# Altium schematic sheet Core.SchDoc
size A4
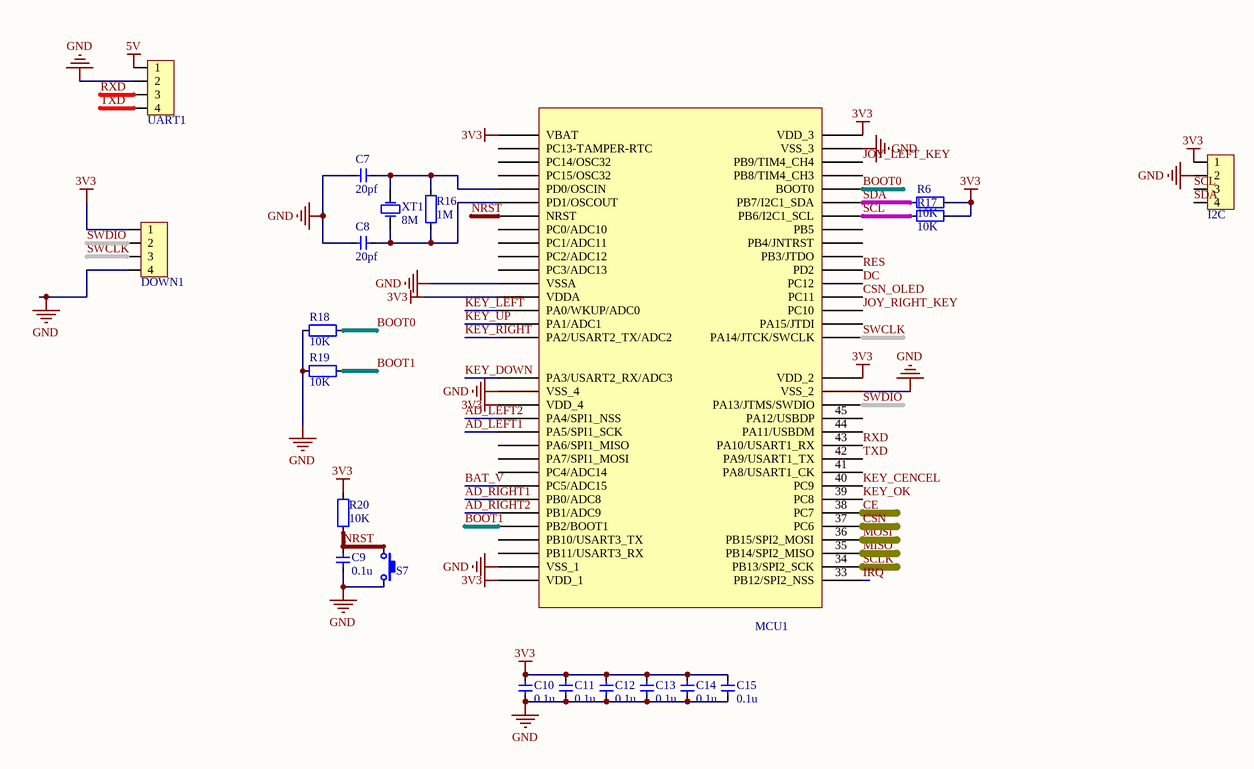
[diagram p0: Core.SchDoc]

## Parts
C7  value 20pf  [CAP_0603]  (hidden comment: Cap_0603)
C8  value 20pf  [CAP_0603]  (hidden comment: Cap_0603)
C9  value 0.1u  [CAP_0603]  (hidden comment: Cap_0603)
C10  value 0.1u  [CAP_0603]  (hidden comment: Cap_0603)
C11  value 0.1u  [CAP_0603]  (hidden comment: Cap_0603)
C12  value 0.1u  [CAP_0603]  (hidden comment: Cap_0603)
C13  value 0.1u  [CAP_0603]  (hidden comment: Cap_0603)
C14  value 0.1u  [CAP_0603]  (hidden comment: Cap_0603)
C15  value 0.1u  [CAP_0603]  (hidden comment: Cap_0603)
DOWN1  HDR1x4_2.54  [HDR1x4_2.54_180]  (value not drawn)
I2C  HDR1x4_2.54  [HDR1x4_2.54_180]  (value not drawn)
MCU1  STM32F103RC  [LQFP_P0.5_64]  (value not drawn)
R6  value 10K  [RES_0603]  (hidden comment: Res_0603)
R16  value 1M  [RES_0603]  (hidden comment: Res_0603)
R17  value 10K  [RES_0603]  (hidden comment: Res_0603)
R18  value 10K  [RES_0603]  (hidden comment: Res_0603)
R19  value 10K  [RES_0603]  (hidden comment: Res_0603)
R20  value 10K  [RES_0603]  (hidden comment: Res_0603)
S7  ButtonTACT_3x4x2_180  [ButtonTACT_3x4x2_180H]  (value not drawn)
UART1  HDR1x4_2.54  [HDR1x4_2.54_180]  (value not drawn)
XT1  value 8M  [XT_5032_2]  (hidden comment: XTAL_5032_2P)

## Nets
3V3: C10.2 C11.2 C12.2 C13.2 C14.2 C15.2 DOWN1.1 I2C.1 MCU1.1(VBAT) MCU1.13(VDDA) MCU1.19(VDD_4) MCU1.32(VDD_1) MCU1.48(VDD_2) MCU1.64(VDD_3) R6.2 R17.2 R20.1
5V: UART1.1
GND: C7.1 C8.1 C9.1 C10.1 C11.1 C12.1 C13.1 C14.1 C15.1 DOWN1.4 I2C.2 MCU1.12(VSSA) MCU1.18(VSS_4) MCU1.31(VSS_1) MCU1.47(VSS_2) MCU1.63(VSS_3) R18.2 R19.2 S7.2 UART1.2
AD_LEFT1: MCU1.21(PA5/SPI1_SCK)
AD_LEFT2: MCU1.20(PA4/SPI1_NSS)
AD_RIGHT1: MCU1.26(PB0/ADC8)
AD_RIGHT2: MCU1.27(PB1/ADC9)
BAT_V: MCU1.25(PC5/ADC15)
BOOT0: MCU1.60(BOOT0) R18.1
BOOT1: MCU1.28(PB2/BOOT1) R19.1
CE: MCU1.38(PC7)
CSN: MCU1.37(PC6)
CSN_OLED: MCU1.52(PC11)
DC: MCU1.53(PC12)
IRQ: MCU1.33(PB12/SPI2_NSS)
JOY_LEFT_KEY: MCU1.62(PB9/TIM4_CH4)
JOY_RIGHT_KEY: MCU1.51(PC10)
KEY_CENCEL: MCU1.40(PC9)
KEY_DOWN: MCU1.17(PA3/USART2_RX/ADC3)
KEY_LEFT: MCU1.14(PA0/WKUP/ADC0)
KEY_OK: MCU1.39(PC8)
KEY_RIGHT: MCU1.16(PA2/USART2_TX/ADC2)
KEY_UP: MCU1.15(PA1/ADC1)
MISO: MCU1.35(PB14/SPI2_MISO)
MOSI: MCU1.36(PB15/SPI2_MOSI)
NRST: C9.2 MCU1.7(NRST) R20.2 S7.1
RES: MCU1.54(PD2)
RXD: MCU1.43(PA10/USART1_RX) UART1.3
SCL: I2C.3 MCU1.58(PB6/I2C1_SCL) R17.1
SCLK: MCU1.34(PB13/SPI2_SCK)
SDA: I2C.4 MCU1.59(PB7/I2C1_SDA) R6.1
SWCLK: DOWN1.3 MCU1.49(PA14/JTCK/SWCLK)
SWDIO: DOWN1.2 MCU1.46(PA13/JTMS/SWDIO)
TXD: MCU1.42(PA9/USART1_TX) UART1.4
NetC7_2: C7.2 MCU1.5(PD0/OSCIN) R16.2 XT1.2(OSC2)
NetC8_2: C8.2 MCU1.6(PD1/OSCOUT) R16.1 XT1.1(OSC1)

Not connected (* = marked no-connect by the designer): MCU1 2(PC13-TAMPER-RTC) 3(PC14/OSC32) 4(PC15/OSC32) 8(PC0/ADC10) 9(PC1/ADC11) 10(PC2/ADC12) 11(PC3/ADC13) 22(PA6/SPI1_MISO) 23(PA7/SPI1_MOSI) 24(PC4/ADC14) 29(PB10/USART3_TX) 30(PB11/USART3_RX) 41(PA8/USART1_CK) 44(PA11/USBDM) 45(PA12/USBDP) 50(PA15/JTDI) 55(PB3/JTDO) 56(PB4/JNTRST) 57(PB5) 61(PB8/TIM4_CH3)

## Library data of the parts
C7-C15 = Cap_0603: Capacitor
DOWN1 I2C UART1 = HDR1x4_2.54: Header
MCU1 = STM32F103RC: MCU
R6 R16-R20 = Res_0603: Resistor
S7 = ButtonTACT_3x4x2_180: Button
XT1 = XTAL_5032_2P: Crystal Oscillator